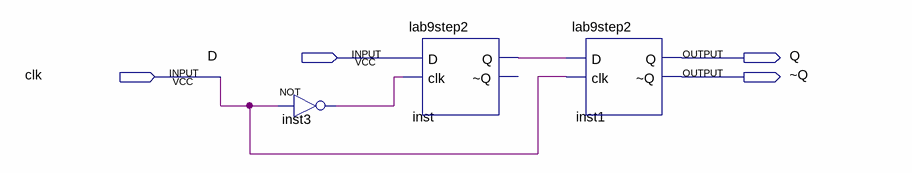
[diagram p0: schematic sheet]
// Quartus schematic lab9step3a.bdf as structural Verilog: 3 symbols, 4 pins
module lab9step3a (
  input  D,
  input  clk,
  output Q,
  output \~Q 
);

  wire inst3_out, inst_q;

  not inst3 (inst3_out, clk);
  lab9step2 inst (.D(D), .clk(inst3_out), .Q(inst_q));  // open: ~Q
  lab9step2 inst1 (.D(inst_q), .clk(clk), .Q(Q), .\~Q (\~Q ));
endmodule
